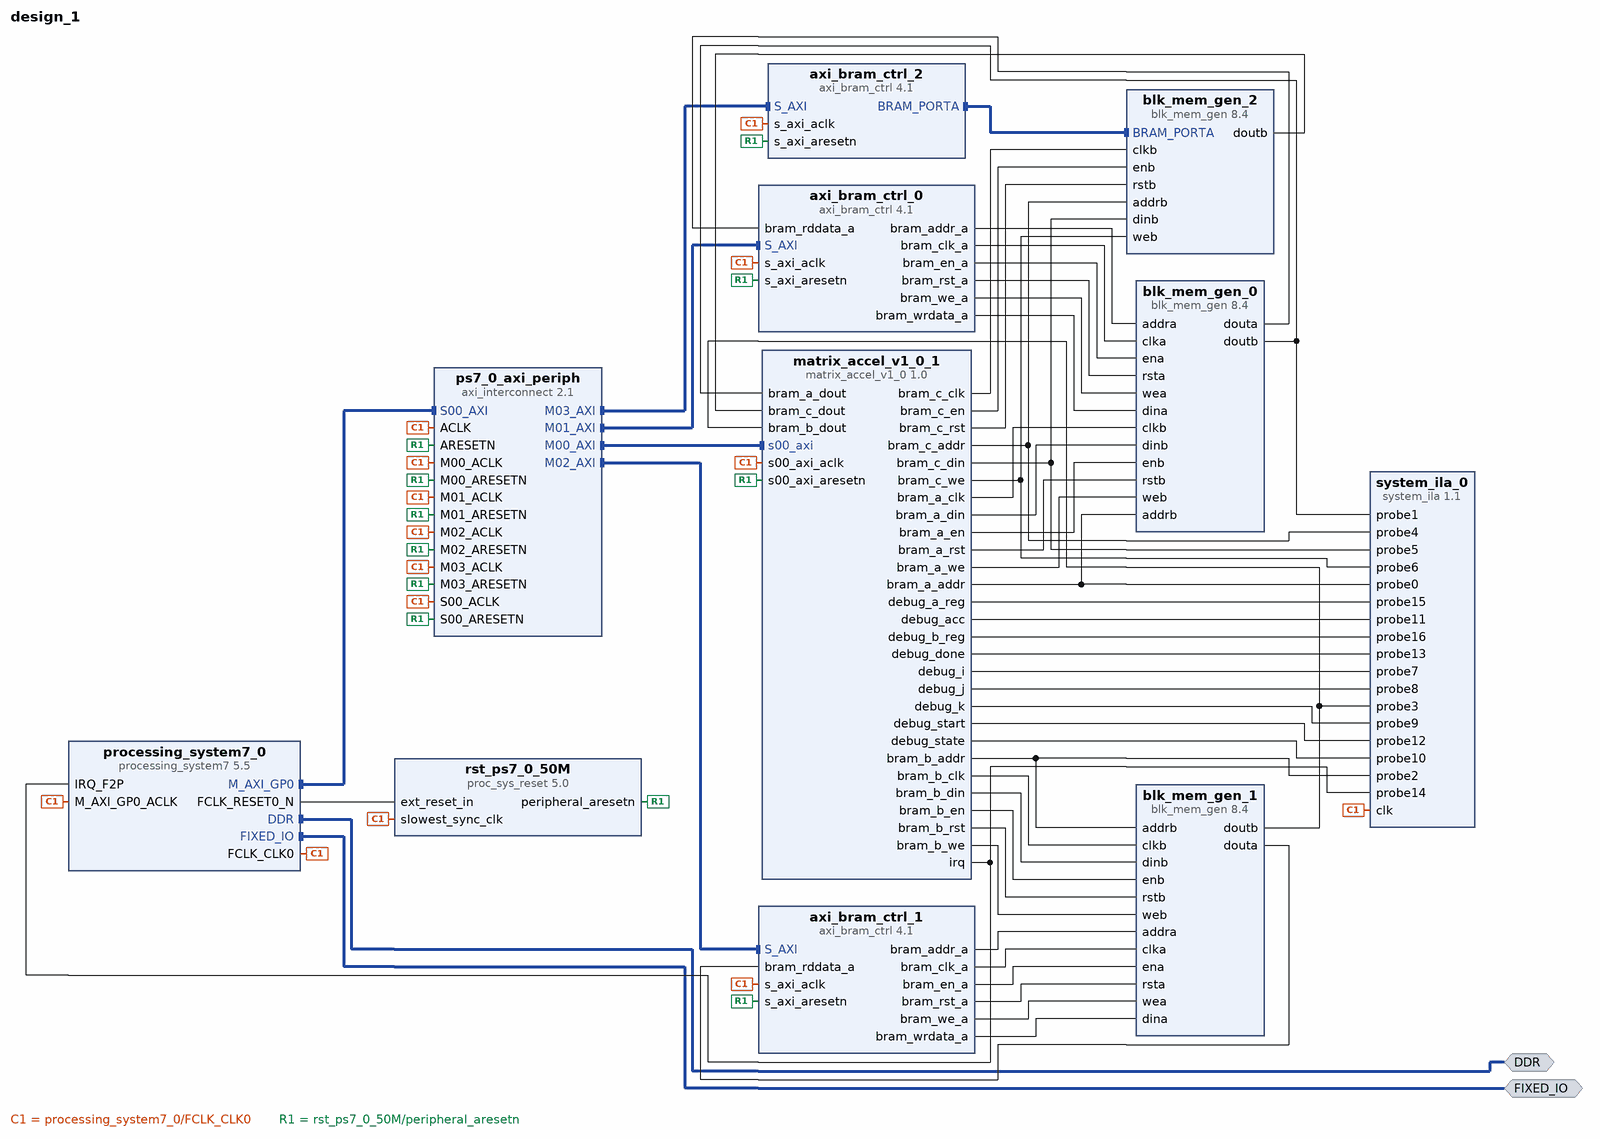
[diagram p0: block diagram of the top level]
# Vivado block design design_1, xc7z010clg400-1, Vivado 2023.1
create_bd_design design_1

create_bd_intf_port -mode Master -vlnv xilinx.com:interface:ddrx_rtl:1.0 DDR
create_bd_intf_port -mode Master -vlnv xilinx.com:display_processing_system7:fixedio_rtl:1.0 FIXED_IO

create_bd_cell -type ip -vlnv xilinx.com:ip:processing_system7:5.5 processing_system7_0
set_property -dict [list \
  CONFIG.PCW_APU_PERIPHERAL_FREQMHZ 666.666666 \
  CONFIG.PCW_ENET0_ENET0_IO {MIO 16 .. 27} \
  CONFIG.PCW_ENET0_GRP_MDIO_ENABLE 1 \
  CONFIG.PCW_ENET0_GRP_MDIO_IO {MIO 52 .. 53} \
  CONFIG.PCW_ENET0_PERIPHERAL_ENABLE 1 \
  CONFIG.PCW_ENET0_RESET_ENABLE 0 \
  CONFIG.PCW_ENET_RESET_ENABLE 1 \
  CONFIG.PCW_ENET_RESET_SELECT {Share reset pin} \
  CONFIG.PCW_GPIO_MIO_GPIO_ENABLE 1 \
  CONFIG.PCW_GPIO_MIO_GPIO_IO MIO \
  CONFIG.PCW_I2C_RESET_ENABLE 1 \
  CONFIG.PCW_IRQ_F2P_INTR 1 \
  CONFIG.PCW_PRESET_BANK1_VOLTAGE {LVCMOS 1.8V} \
  CONFIG.PCW_QSPI_GRP_FBCLK_ENABLE 1 \
  CONFIG.PCW_QSPI_GRP_FBCLK_IO {MIO 8} \
  CONFIG.PCW_QSPI_GRP_SINGLE_SS_ENABLE 1 \
  CONFIG.PCW_QSPI_GRP_SINGLE_SS_IO {MIO 1 .. 6} \
  CONFIG.PCW_QSPI_PERIPHERAL_ENABLE 1 \
  CONFIG.PCW_QSPI_QSPI_IO {MIO 1 .. 6} \
  CONFIG.PCW_SD0_GRP_CD_ENABLE 1 \
  CONFIG.PCW_SD0_GRP_CD_IO {MIO 47} \
  CONFIG.PCW_SD0_GRP_WP_ENABLE 0 \
  CONFIG.PCW_SD0_PERIPHERAL_ENABLE 1 \
  CONFIG.PCW_SD0_SD0_IO {MIO 40 .. 45} \
  CONFIG.PCW_SDIO_PERIPHERAL_FREQMHZ 50 \
  CONFIG.PCW_SINGLE_QSPI_DATA_MODE x4 \
  CONFIG.PCW_UART1_PERIPHERAL_ENABLE 1 \
  CONFIG.PCW_UART1_UART1_IO {MIO 48 .. 49} \
  CONFIG.PCW_UART_PERIPHERAL_FREQMHZ 100 \
  CONFIG.PCW_UIPARAM_DDR_FREQ_MHZ 533.333333 \
  CONFIG.PCW_UIPARAM_DDR_MEMORY_TYPE {DDR 3 (Low Voltage)} \
  CONFIG.PCW_UIPARAM_DDR_PARTNO {MT41K256M16 RE-125} \
  CONFIG.PCW_USB0_PERIPHERAL_ENABLE 1 \
  CONFIG.PCW_USB0_RESET_ENABLE 1 \
  CONFIG.PCW_USB0_RESET_IO {MIO 46} \
  CONFIG.PCW_USB0_USB0_IO {MIO 28 .. 39} \
  CONFIG.PCW_USB_RESET_ENABLE 1 \
  CONFIG.PCW_USB_RESET_SELECT {Share reset pin} \
  CONFIG.PCW_USE_FABRIC_INTERRUPT 1 \
] [get_bd_cells processing_system7_0]
# 296 more settings of processing_system7_0 are not shown: defaults, MIO pin electricals, DDR timing, and values the tool derives
create_bd_cell -type ip -vlnv xilinx.com:ip:axi_interconnect:2.1 ps7_0_axi_periph
set_property -dict {CONFIG.NUM_MI 4} [get_bd_cells ps7_0_axi_periph]
create_bd_cell -type ip -vlnv xilinx.com:ip:proc_sys_reset:5.0 rst_ps7_0_50M
create_bd_cell -type ip -vlnv xilinx.com:ip:axi_bram_ctrl:4.1 axi_bram_ctrl_0
set_property -dict {CONFIG.DATA_WIDTH 64 CONFIG.SINGLE_PORT_BRAM 1} [get_bd_cells axi_bram_ctrl_0]
create_bd_cell -type ip -vlnv xilinx.com:ip:blk_mem_gen:8.4 blk_mem_gen_0
set_property -dict [list \
  CONFIG.Assume_Synchronous_Clk true \
  CONFIG.Enable_32bit_Address true \
  CONFIG.Memory_Type True_Dual_Port_RAM \
  CONFIG.use_bram_block Stand_Alone \
] [get_bd_cells blk_mem_gen_0]
create_bd_cell -type ip -vlnv xilinx.com:ip:axi_bram_ctrl:4.1 axi_bram_ctrl_1
set_property -dict {CONFIG.DATA_WIDTH 64 CONFIG.SINGLE_PORT_BRAM 1} [get_bd_cells axi_bram_ctrl_1]
create_bd_cell -type ip -vlnv xilinx.com:ip:axi_bram_ctrl:4.1 axi_bram_ctrl_2
set_property -dict {CONFIG.DATA_WIDTH 32 CONFIG.SINGLE_PORT_BRAM 1} [get_bd_cells axi_bram_ctrl_2]
create_bd_cell -type ip -vlnv xilinx.com:ip:blk_mem_gen:8.4 blk_mem_gen_1
set_property -dict [list \
  CONFIG.Assume_Synchronous_Clk true \
  CONFIG.Enable_32bit_Address true \
  CONFIG.Memory_Type True_Dual_Port_RAM \
  CONFIG.use_bram_block Stand_Alone \
] [get_bd_cells blk_mem_gen_1]
create_bd_cell -type ip -vlnv xilinx.com:ip:blk_mem_gen:8.4 blk_mem_gen_2
set_property -dict [list \
  CONFIG.Assume_Synchronous_Clk true \
  CONFIG.Enable_32bit_Address true \
  CONFIG.Memory_Type True_Dual_Port_RAM \
  CONFIG.use_bram_block BRAM_Controller \
] [get_bd_cells blk_mem_gen_2]
create_bd_cell -type ip -vlnv xilinx.com:ip:system_ila:1.1 system_ila_0
set_property -dict [list \
  CONFIG.C_DATA_DEPTH 4096 \
  CONFIG.C_MON_TYPE NATIVE \
  CONFIG.C_NUM_MONITOR_SLOTS 12 \
  CONFIG.C_NUM_OF_PROBES 17 \
] [get_bd_cells system_ila_0]
create_bd_cell -type ip -vlnv xilinx.com:user:matrix_accel_v1_0:1.0 matrix_accel_v1_0_1

# ---- connections ----

connect_bd_intf_net [get_bd_intf_pins blk_mem_gen_2/BRAM_PORTA] [get_bd_intf_pins axi_bram_ctrl_2/BRAM_PORTA]
connect_bd_intf_net [get_bd_intf_ports DDR] [get_bd_intf_pins processing_system7_0/DDR]
connect_bd_intf_net [get_bd_intf_ports FIXED_IO] [get_bd_intf_pins processing_system7_0/FIXED_IO]
connect_bd_intf_net [get_bd_intf_pins processing_system7_0/M_AXI_GP0] [get_bd_intf_pins ps7_0_axi_periph/S00_AXI]
connect_bd_intf_net [get_bd_intf_pins ps7_0_axi_periph/M00_AXI] [get_bd_intf_pins matrix_accel_v1_0_1/s00_axi]
connect_bd_intf_net [get_bd_intf_pins ps7_0_axi_periph/M01_AXI] [get_bd_intf_pins axi_bram_ctrl_0/S_AXI]
connect_bd_intf_net [get_bd_intf_pins axi_bram_ctrl_1/S_AXI] [get_bd_intf_pins ps7_0_axi_periph/M02_AXI]
connect_bd_intf_net [get_bd_intf_pins axi_bram_ctrl_2/S_AXI] [get_bd_intf_pins ps7_0_axi_periph/M03_AXI]
connect_bd_net [get_bd_pins axi_bram_ctrl_0/bram_addr_a] [get_bd_pins blk_mem_gen_0/addra]
connect_bd_net [get_bd_pins axi_bram_ctrl_0/bram_clk_a] [get_bd_pins blk_mem_gen_0/clka]
connect_bd_net [get_bd_pins axi_bram_ctrl_0/bram_en_a] [get_bd_pins blk_mem_gen_0/ena]
connect_bd_net [get_bd_pins axi_bram_ctrl_0/bram_rst_a] [get_bd_pins blk_mem_gen_0/rsta]
connect_bd_net [get_bd_pins axi_bram_ctrl_0/bram_we_a] [get_bd_pins blk_mem_gen_0/wea]
connect_bd_net [get_bd_pins axi_bram_ctrl_0/bram_wrdata_a] [get_bd_pins blk_mem_gen_0/dina]
connect_bd_net [get_bd_pins axi_bram_ctrl_1/bram_addr_a] [get_bd_pins blk_mem_gen_1/addra]
connect_bd_net [get_bd_pins axi_bram_ctrl_1/bram_clk_a] [get_bd_pins blk_mem_gen_1/clka]
connect_bd_net [get_bd_pins axi_bram_ctrl_1/bram_en_a] [get_bd_pins blk_mem_gen_1/ena]
connect_bd_net [get_bd_pins axi_bram_ctrl_1/bram_rst_a] [get_bd_pins blk_mem_gen_1/rsta]
connect_bd_net [get_bd_pins axi_bram_ctrl_1/bram_we_a] [get_bd_pins blk_mem_gen_1/wea]
connect_bd_net [get_bd_pins axi_bram_ctrl_1/bram_wrdata_a] [get_bd_pins blk_mem_gen_1/dina]
connect_bd_net [get_bd_pins blk_mem_gen_0/douta] [get_bd_pins axi_bram_ctrl_0/bram_rddata_a]
connect_bd_net [get_bd_pins blk_mem_gen_0/doutb] [get_bd_pins system_ila_0/probe1] [get_bd_pins matrix_accel_v1_0_1/bram_a_dout]
connect_bd_net [get_bd_pins blk_mem_gen_1/douta] [get_bd_pins axi_bram_ctrl_1/bram_rddata_a]
connect_bd_net [get_bd_pins blk_mem_gen_1/doutb] [get_bd_pins system_ila_0/probe3] [get_bd_pins matrix_accel_v1_0_1/bram_b_dout]
connect_bd_net [get_bd_pins blk_mem_gen_2/doutb] [get_bd_pins matrix_accel_v1_0_1/bram_c_dout]
connect_bd_net -net matrix_accel_0_bram_a_addr [get_bd_pins matrix_accel_v1_0_1/bram_a_addr] \
  [get_bd_pins blk_mem_gen_0/addrb] [get_bd_pins system_ila_0/probe0]
connect_bd_net -net matrix_accel_0_bram_b_addr [get_bd_pins matrix_accel_v1_0_1/bram_b_addr] \
  [get_bd_pins blk_mem_gen_1/addrb] [get_bd_pins system_ila_0/probe2]
connect_bd_net -net matrix_accel_0_bram_c_addr [get_bd_pins matrix_accel_v1_0_1/bram_c_addr] \
  [get_bd_pins blk_mem_gen_2/addrb] [get_bd_pins system_ila_0/probe4]
connect_bd_net -net matrix_accel_0_bram_c_din [get_bd_pins matrix_accel_v1_0_1/bram_c_din] \
  [get_bd_pins blk_mem_gen_2/dinb] [get_bd_pins system_ila_0/probe5]
connect_bd_net -net matrix_accel_0_bram_c_we [get_bd_pins matrix_accel_v1_0_1/bram_c_we] \
  [get_bd_pins blk_mem_gen_2/web] [get_bd_pins system_ila_0/probe6]
connect_bd_net -net matrix_accel_0_irq [get_bd_pins matrix_accel_v1_0_1/irq] \
  [get_bd_pins processing_system7_0/IRQ_F2P] [get_bd_pins system_ila_0/probe14]
connect_bd_net [get_bd_pins matrix_accel_v1_0_1/bram_a_clk] [get_bd_pins blk_mem_gen_0/clkb]
connect_bd_net [get_bd_pins matrix_accel_v1_0_1/bram_a_din] [get_bd_pins blk_mem_gen_0/dinb]
connect_bd_net [get_bd_pins matrix_accel_v1_0_1/bram_a_en] [get_bd_pins blk_mem_gen_0/enb]
connect_bd_net [get_bd_pins matrix_accel_v1_0_1/bram_a_rst] [get_bd_pins blk_mem_gen_0/rstb]
connect_bd_net [get_bd_pins matrix_accel_v1_0_1/bram_a_we] [get_bd_pins blk_mem_gen_0/web]
connect_bd_net [get_bd_pins matrix_accel_v1_0_1/bram_b_clk] [get_bd_pins blk_mem_gen_1/clkb]
connect_bd_net [get_bd_pins matrix_accel_v1_0_1/bram_b_din] [get_bd_pins blk_mem_gen_1/dinb]
connect_bd_net [get_bd_pins matrix_accel_v1_0_1/bram_b_en] [get_bd_pins blk_mem_gen_1/enb]
connect_bd_net [get_bd_pins matrix_accel_v1_0_1/bram_b_rst] [get_bd_pins blk_mem_gen_1/rstb]
connect_bd_net [get_bd_pins matrix_accel_v1_0_1/bram_b_we] [get_bd_pins blk_mem_gen_1/web]
connect_bd_net [get_bd_pins matrix_accel_v1_0_1/bram_c_clk] [get_bd_pins blk_mem_gen_2/clkb]
connect_bd_net [get_bd_pins matrix_accel_v1_0_1/bram_c_en] [get_bd_pins blk_mem_gen_2/enb]
connect_bd_net [get_bd_pins matrix_accel_v1_0_1/bram_c_rst] [get_bd_pins blk_mem_gen_2/rstb]
connect_bd_net [get_bd_pins matrix_accel_v1_0_1/debug_a_reg] [get_bd_pins system_ila_0/probe15]
connect_bd_net [get_bd_pins matrix_accel_v1_0_1/debug_acc] [get_bd_pins system_ila_0/probe11]
connect_bd_net [get_bd_pins matrix_accel_v1_0_1/debug_b_reg] [get_bd_pins system_ila_0/probe16]
connect_bd_net [get_bd_pins matrix_accel_v1_0_1/debug_done] [get_bd_pins system_ila_0/probe13]
connect_bd_net [get_bd_pins matrix_accel_v1_0_1/debug_i] [get_bd_pins system_ila_0/probe7]
connect_bd_net [get_bd_pins matrix_accel_v1_0_1/debug_j] [get_bd_pins system_ila_0/probe8]
connect_bd_net [get_bd_pins matrix_accel_v1_0_1/debug_k] [get_bd_pins system_ila_0/probe9]
connect_bd_net [get_bd_pins matrix_accel_v1_0_1/debug_start] [get_bd_pins system_ila_0/probe12]
connect_bd_net [get_bd_pins matrix_accel_v1_0_1/debug_state] [get_bd_pins system_ila_0/probe10]
connect_bd_net [get_bd_pins processing_system7_0/FCLK_CLK0] \
  [get_bd_pins processing_system7_0/M_AXI_GP0_ACLK] [get_bd_pins ps7_0_axi_periph/S00_ACLK] \
  [get_bd_pins rst_ps7_0_50M/slowest_sync_clk] [get_bd_pins ps7_0_axi_periph/M00_ACLK] [get_bd_pins ps7_0_axi_periph/ACLK] \
  [get_bd_pins axi_bram_ctrl_0/s_axi_aclk] [get_bd_pins ps7_0_axi_periph/M01_ACLK] [get_bd_pins axi_bram_ctrl_1/s_axi_aclk] \
  [get_bd_pins ps7_0_axi_periph/M02_ACLK] [get_bd_pins axi_bram_ctrl_2/s_axi_aclk] [get_bd_pins ps7_0_axi_periph/M03_ACLK] \
  [get_bd_pins system_ila_0/clk] [get_bd_pins matrix_accel_v1_0_1/s00_axi_aclk]
connect_bd_net [get_bd_pins processing_system7_0/FCLK_RESET0_N] [get_bd_pins rst_ps7_0_50M/ext_reset_in]
connect_bd_net [get_bd_pins rst_ps7_0_50M/peripheral_aresetn] \
  [get_bd_pins ps7_0_axi_periph/S00_ARESETN] [get_bd_pins ps7_0_axi_periph/M00_ARESETN] \
  [get_bd_pins ps7_0_axi_periph/ARESETN] [get_bd_pins axi_bram_ctrl_0/s_axi_aresetn] \
  [get_bd_pins ps7_0_axi_periph/M01_ARESETN] [get_bd_pins axi_bram_ctrl_1/s_axi_aresetn] \
  [get_bd_pins ps7_0_axi_periph/M02_ARESETN] [get_bd_pins axi_bram_ctrl_2/s_axi_aresetn] \
  [get_bd_pins ps7_0_axi_periph/M03_ARESETN] [get_bd_pins matrix_accel_v1_0_1/s00_axi_aresetn]
set_property HDL_ATTRIBUTE.BMM_INFO_PROCESSOR {arm > design_1 axi_bram_ctrl_2} [get_bd_cells processing_system7_0]
set_property HDL_ATTRIBUTE.KEEP_HIERARCHY yes [get_bd_cells processing_system7_0]
set_property HDL_ATTRIBUTE.BMM_INFO_ADDRESS_SPACE {byte  0x40000000 64 > design_1 blk_mem_gen_0} [get_bd_cells axi_bram_ctrl_0]
set_property HDL_ATTRIBUTE.KEEP_HIERARCHY yes [get_bd_cells axi_bram_ctrl_0]
set_property HDL_ATTRIBUTE.BMM_INFO_ADDRESS_SPACE {byte  0x42000000 64 > design_1 blk_mem_gen_1} [get_bd_cells axi_bram_ctrl_1]
set_property HDL_ATTRIBUTE.KEEP_HIERARCHY yes [get_bd_cells axi_bram_ctrl_1]
set_property HDL_ATTRIBUTE.BMM_INFO_ADDRESS_SPACE {byte  0x44000000 32 > design_1 blk_mem_gen_2} [get_bd_cells axi_bram_ctrl_2]
set_property HDL_ATTRIBUTE.KEEP_HIERARCHY yes [get_bd_cells axi_bram_ctrl_2]

# ---- address map ----
assign_bd_address -offset 0x40000000 -range 8K -target_address_space [get_bd_addr_spaces processing_system7_0/Data] [get_bd_addr_segs axi_bram_ctrl_0/S_AXI/Mem0]
assign_bd_address -offset 0x40002000 -range 4K -target_address_space [get_bd_addr_spaces processing_system7_0/Data] [get_bd_addr_segs matrix_accel_v1_0_1/s00_axi/reg0]
assign_bd_address -offset 0x42000000 -range 8K -target_address_space [get_bd_addr_spaces processing_system7_0/Data] [get_bd_addr_segs axi_bram_ctrl_1/S_AXI/Mem0]
assign_bd_address -offset 0x44000000 -range 8K -target_address_space [get_bd_addr_spaces processing_system7_0/Data] [get_bd_addr_segs axi_bram_ctrl_2/S_AXI/Mem0]

validate_bd_design
save_bd_design
